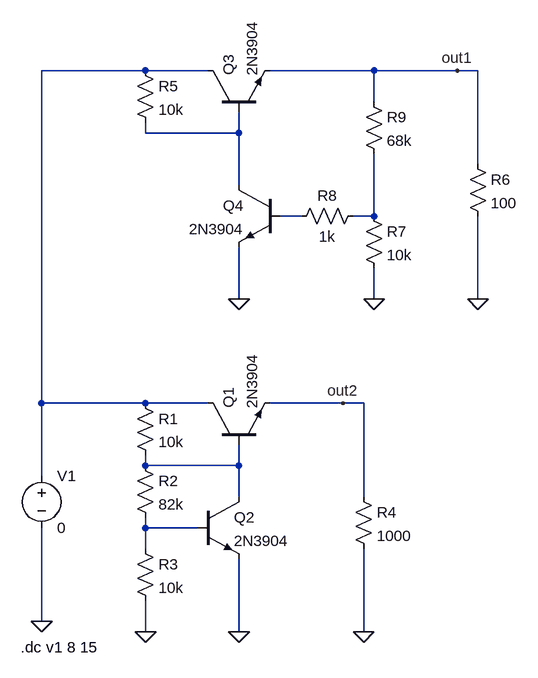
[diagram p0: schematic discrete_cheap_LDO.asc]
discrete_cheap_LDO.asc, the LTspice schematic file:
Version 4
SHEET 1 1004 680
WIRE 176 -480 16 -480
WIRE 272 -480 176 -480
WIRE 528 -480 368 -480
WIRE 656 -480 528 -480
WIRE 688 -480 656 -480
WIRE 528 -432 528 -480
WIRE 176 -384 176 -400
WIRE 320 -384 320 -416
WIRE 320 -384 176 -384
WIRE 688 -336 688 -480
WIRE 320 -304 320 -384
WIRE 416 -256 384 -256
WIRE 528 -256 528 -352
WIRE 528 -256 496 -256
WIRE 320 -128 320 -208
WIRE 528 -128 528 -176
WIRE 688 -128 688 -256
WIRE 16 32 16 -480
WIRE 176 32 16 32
WIRE 272 32 176 32
WIRE 480 32 368 32
WIRE 512 32 480 32
WIRE 176 128 176 112
WIRE 320 128 320 96
WIRE 320 128 176 128
WIRE 16 144 16 32
WIRE 320 176 320 128
WIRE 512 176 512 32
WIRE 176 224 176 208
WIRE 256 224 176 224
WIRE 176 256 176 224
WIRE 16 368 16 224
WIRE 176 384 176 336
WIRE 320 384 320 272
WIRE 512 384 512 256
FLAG 16 368 0
FLAG 176 384 0
FLAG 320 384 0
FLAG 512 384 0
FLAG 528 -128 0
FLAG 688 -128 0
FLAG 656 -480 out1
FLAG 480 32 out2
FLAG 320 -128 0
SYMBOL voltage 16 128 R0
WINDOW 123 0 0 Left 0
WINDOW 39 0 0 Left 0
SYMATTR InstName V1
SYMATTR Value 0
SYMBOL npn 272 96 R270
SYMATTR InstName Q1
SYMATTR Value 2N3904
SYMBOL npn 256 176 R0
SYMATTR InstName Q2
SYMATTR Value 2N3904
SYMBOL res 160 16 R0
SYMATTR InstName R1
SYMATTR Value 10k
SYMBOL res 160 112 R0
SYMATTR InstName R2
SYMATTR Value 82k
SYMBOL res 160 240 R0
SYMATTR InstName R3
SYMATTR Value 10k
SYMBOL res 496 160 R0
SYMATTR InstName R4
SYMATTR Value 1000
SYMBOL npn 272 -416 R270
SYMATTR InstName Q3
SYMATTR Value 2N3904
SYMBOL res 160 -496 R0
SYMATTR InstName R5
SYMATTR Value 10k
SYMBOL res 512 -272 R0
SYMATTR InstName R7
SYMATTR Value 10k
SYMBOL res 672 -352 R0
SYMATTR InstName R6
SYMATTR Value 100
SYMBOL npn 384 -304 M0
SYMATTR InstName Q4
SYMATTR Value 2N3904
SYMBOL res 512 -272 R90
WINDOW 0 0 56 VBottom 2
WINDOW 3 32 56 VTop 2
SYMATTR InstName R8
SYMATTR Value 1k
SYMBOL res 512 -448 R0
SYMATTR InstName R9
SYMATTR Value 68k
TEXT -16 408 Left 2 !.dc v1 8 15

The netlist it stands for:
* discrete_cheap_LDO.asc
V1 N001 0 0
Q1 N001 N005 out2 0 2N3904
Q2 N005 N006 0 0 2N3904
R1 N001 N005 10k
R2 N005 N006 82k
R3 N006 0 10k
R4 out2 0 1000
Q3 N001 N002 out1 0 2N3904
R5 N001 N002 10k
R7 N004 0 10k
R6 out1 0 100
Q4 N002 N003 0 0 2N3904
R8 N004 N003 1k
R9 out1 N004 68k
.model NPN NPN
.model PNP PNP
.lib standard.bjt
.dc v1 8 15
.backanno
.end